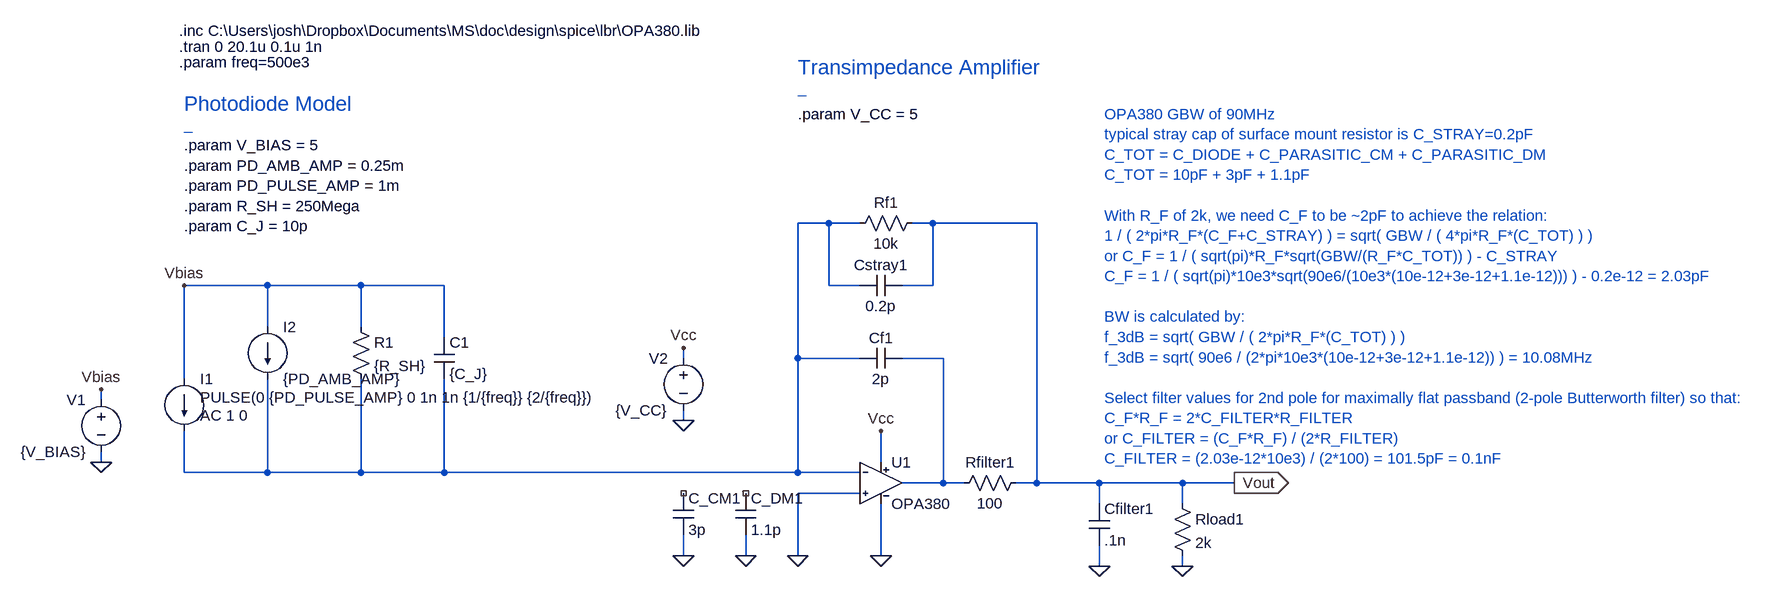
[diagram p0: schematic rx.asc]
rx.asc, the LTspice schematic file:
Version 4
SHEET 1 1920 680
WIRE 240 -176 192 -176
WIRE 288 -176 240 -176
WIRE 400 -176 368 -176
WIRE 560 -176 400 -176
WIRE -624 -80 -752 -80
WIRE -480 -80 -624 -80
WIRE -352 -80 -480 -80
WIRE 240 -80 240 -176
WIRE 288 -80 240 -80
WIRE 400 -80 400 -176
WIRE 400 -80 352 -80
WIRE -624 -16 -624 -80
WIRE -480 -16 -480 -80
WIRE -352 0 -352 -80
WIRE 16 32 16 16
WIRE 192 32 192 -176
WIRE 288 32 192 32
WIRE 416 32 352 32
WIRE -752 64 -752 -80
WIRE -880 96 -880 80
WIRE 16 128 16 112
WIRE -880 192 -880 176
WIRE 320 192 320 144
WIRE -752 208 -752 144
WIRE -624 208 -624 64
WIRE -624 208 -752 208
WIRE -480 208 -480 64
WIRE -480 208 -624 208
WIRE -352 208 -352 64
WIRE -352 208 -480 208
WIRE 192 208 192 32
WIRE 192 208 -352 208
WIRE 288 208 192 208
WIRE 416 224 416 32
WIRE 416 224 352 224
WIRE 448 224 416 224
WIRE 560 224 560 -176
WIRE 560 224 528 224
WIRE 656 224 560 224
WIRE 784 224 656 224
WIRE 864 224 784 224
WIRE 288 240 192 240
WIRE 656 256 656 224
WIRE 784 256 784 224
WIRE 16 336 16 304
WIRE 112 336 112 304
WIRE 192 336 192 240
WIRE 320 336 320 256
WIRE 656 352 656 320
WIRE 784 352 784 336
FLAG -880 192 0
FLAG -880 80 Vbias
FLAG -752 -80 Vbias
FLAG 16 128 0
FLAG 16 16 Vcc
FLAG 320 144 Vcc
FLAG 320 336 0
FLAG 656 352 0
FLAG 192 336 0
FLAG 112 336 0
FLAG 16 336 0
FLAG 784 352 0
FLAG 864 224 Vout
IOPIN 864 224 Out
SYMBOL current -752 64 R0
WINDOW 3 24 28 Left 2
WINDOW 123 24 56 Left 2
WINDOW 39 0 0 Left 2
SYMATTR Value PULSE(0 {PD_PULSE_AMP} 0 1n 1n {1/{freq}} {2/{freq}})
SYMATTR Value2 AC 1 0
SYMATTR InstName I1
SYMBOL current -624 -16 R0
WINDOW 123 0 0 Left 2
WINDOW 39 0 0 Left 2
SYMATTR InstName I2
SYMATTR Value {PD_AMB_AMP}
SYMBOL cap -368 0 R0
SYMATTR InstName C1
SYMATTR Value {C_J}
SYMBOL res -496 -32 R0
SYMATTR InstName R1
SYMATTR Value {R_SH}
SYMBOL voltage -880 80 M0
WINDOW 123 0 0 Left 2
WINDOW 39 0 0 Left 2
SYMATTR InstName V1
SYMATTR Value {V_BIAS}
SYMBOL voltage 16 16 M0
WINDOW 123 0 0 Left 2
WINDOW 39 0 0 Left 2
SYMATTR InstName V2
SYMATTR Value {V_CC}
SYMBOL res 272 -160 R270
WINDOW 0 32 56 VTop 2
WINDOW 3 0 56 VBottom 2
SYMATTR InstName Rf1
SYMATTR Value 10k
SYMBOL cap 288 -64 R270
WINDOW 0 32 32 VTop 2
WINDOW 3 0 32 VBottom 2
SYMATTR InstName Cstray1
SYMATTR Value 0.2p
SYMBOL OPA380 320 160 R0
SYMATTR InstName U1
SYMBOL res 432 240 R270
WINDOW 0 32 56 VTop 2
WINDOW 3 0 56 VBottom 2
SYMATTR InstName Rfilter1
SYMATTR Value 100
SYMBOL cap 640 256 R0
SYMATTR InstName Cfilter1
SYMATTR Value .1n
SYMBOL cap 288 48 R270
WINDOW 0 32 32 VTop 2
WINDOW 3 0 32 VBottom 2
SYMATTR InstName Cf1
SYMATTR Value 2p
SYMBOL cap 0 240 R0
SYMATTR InstName C_CM1
SYMATTR Value 3p
SYMBOL cap 96 240 R0
SYMATTR InstName C_DM1
SYMATTR Value 1.1p
SYMBOL res 768 240 R0
SYMATTR InstName Rload1
SYMATTR Value 2k
TEXT -760 -472 Left 2 !.inc C:\\Users\\josh\\Dropbox\\Documents\\MS\\doc\\design\\spice\\lbr\\OPA380.lib
TEXT -760 -448 Left 2 !.tran 0 20.1u 0.1u 1n
TEXT -760 -424 Left 2 !.param freq=500e3
TEXT -752 -360 Left 3 ;Photodiode Model
TEXT -752 -296 Left 2 !.param V_BIAS = 5\n.param PD_AMB_AMP = 0.25m\n.param PD_PULSE_AMP = 1m\n.param R_SH = 250Mega\n.param C_J = 10p
TEXT -752 -328 Left 2 ;_
TEXT 664 -344 Left 2 ;OPA380 GBW of 90MHz\ntypical stray cap of surface mount resistor is C_STRAY=0.2pF\nC_TOT = C_DIODE + C_PARASITIC_CM + C_PARASITIC_DM\nC_TOT = 10pF + 3pF + 1.1pF\n \nWith R_F of 2k, we need C_F to be ~2pF to achieve the relation:\n1 / ( 2*pi*R_F*(C_F+C_STRAY) ) = sqrt( GBW / ( 4*pi*R_F*(C_TOT) ) )\nor C_F = 1 / ( sqrt(pi)*R_F*sqrt(GBW/(R_F*C_TOT)) ) - C_STRAY\nC_F = 1 / ( sqrt(pi)*10e3*sqrt(90e6/(10e3*(10e-12+3e-12+1.1e-12))) ) - 0.2e-12 = 2.03pF\n \nBW is calculated by:\nf_3dB = sqrt( GBW / ( 2*pi*R_F*(C_TOT) ) )\nf_3dB = sqrt( 90e6 / (2*pi*10e3*(10e-12+3e-12+1.1e-12)) ) = 10.08MHz\n \nSelect filter values for 2nd pole for maximally flat passband (2-pole Butterworth filter) so that:\nC_F*R_F = 2*C_FILTER*R_FILTER\nor C_FILTER = (C_F*R_F) / (2*R_FILTER)\nC_FILTER = (2.03e-12*10e3) / (2*100) = 101.5pF = 0.1nF
TEXT 192 -416 Left 3 ;Transimpedance Amplifier
TEXT 192 -344 Left 2 !.param V_CC = 5
TEXT 192 -384 Left 2 ;_

The netlist it stands for:
* rx.asc
I1 Vbias N001 PULSE(0 {PD_PULSE_AMP} 0 1n 1n {1/{freq}} {2/{freq}}) AC 1 0
I2 Vbias N001 {PD_AMB_AMP}
C1 Vbias N001 {C_J}
R1 Vbias N001 {R_SH}
V1 Vbias 0 {V_BIAS}
V2 Vcc 0 {V_CC}
Rf1 N001 Vout 10k
Cstray1 N001 Vout 0.2p
XU1 0 N001 Vcc 0 N002 OPA380  ; pins In+ In- V+ V- OUT
Rfilter1 N002 Vout 100
Cfilter1 Vout 0 .1n
Cf1 N001 N002 2p
C_CM1 NC_01 0 3p
C_DM1 NC_02 0 1.1p
Rload1 Vout 0 2k
.inc C:\Users\josh\Dropbox\Documents\MS\doc\design\spice\lbr\OPA380.lib
.tran 0 20.1u 0.1u 1n
.param freq=500e3
* Photodiode Model
.param V_BIAS = 5
.param PD_AMB_AMP = 0.25m
.param PD_PULSE_AMP = 1m
.param R_SH = 250Mega
.param C_J = 10p
* _
* OPA380 GBW of 90MHz
* typical stray cap of surface mount resistor is C_STRAY=0.2pF
* C_TOT = C_DIODE + C_PARASITIC_CM + C_PARASITIC_DM
* C_TOT = 10pF + 3pF + 1.1pF
* With R_F of 2k, we need C_F to be ~2pF to achieve the relation:
* 1 / ( 2*pi*R_F*(C_F+C_STRAY) ) = sqrt( GBW / ( 4*pi*R_F*(C_TOT) ) )
* or C_F = 1 / ( sqrt(pi)*R_F*sqrt(GBW/(R_F*C_TOT)) ) - C_STRAY
* C_F = 1 / ( sqrt(pi)*10e3*sqrt(90e6/(10e3*(10e-12+3e-12+1.1e-12))) ) - 0.2e-12 = 2.03pF
* BW is calculated by:
* f_3dB = sqrt( GBW / ( 2*pi*R_F*(C_TOT) ) )
* f_3dB = sqrt( 90e6 / (2*pi*10e3*(10e-12+3e-12+1.1e-12)) ) = 10.08MHz
* Select filter values for 2nd pole for maximally flat passband (2-pole Butterworth filter) so that:
* C_F*R_F = 2*C_FILTER*R_FILTER
* or C_FILTER = (C_F*R_F) / (2*R_FILTER)
* C_FILTER = (2.03e-12*10e3) / (2*100) = 101.5pF = 0.1nF
* Transimpedance Amplifier
.param V_CC = 5
* _
.backanno
.end